# EAGLE design seq__control_pad_03 (EAGLE 7.7.0)

## Sheet 1 of 2
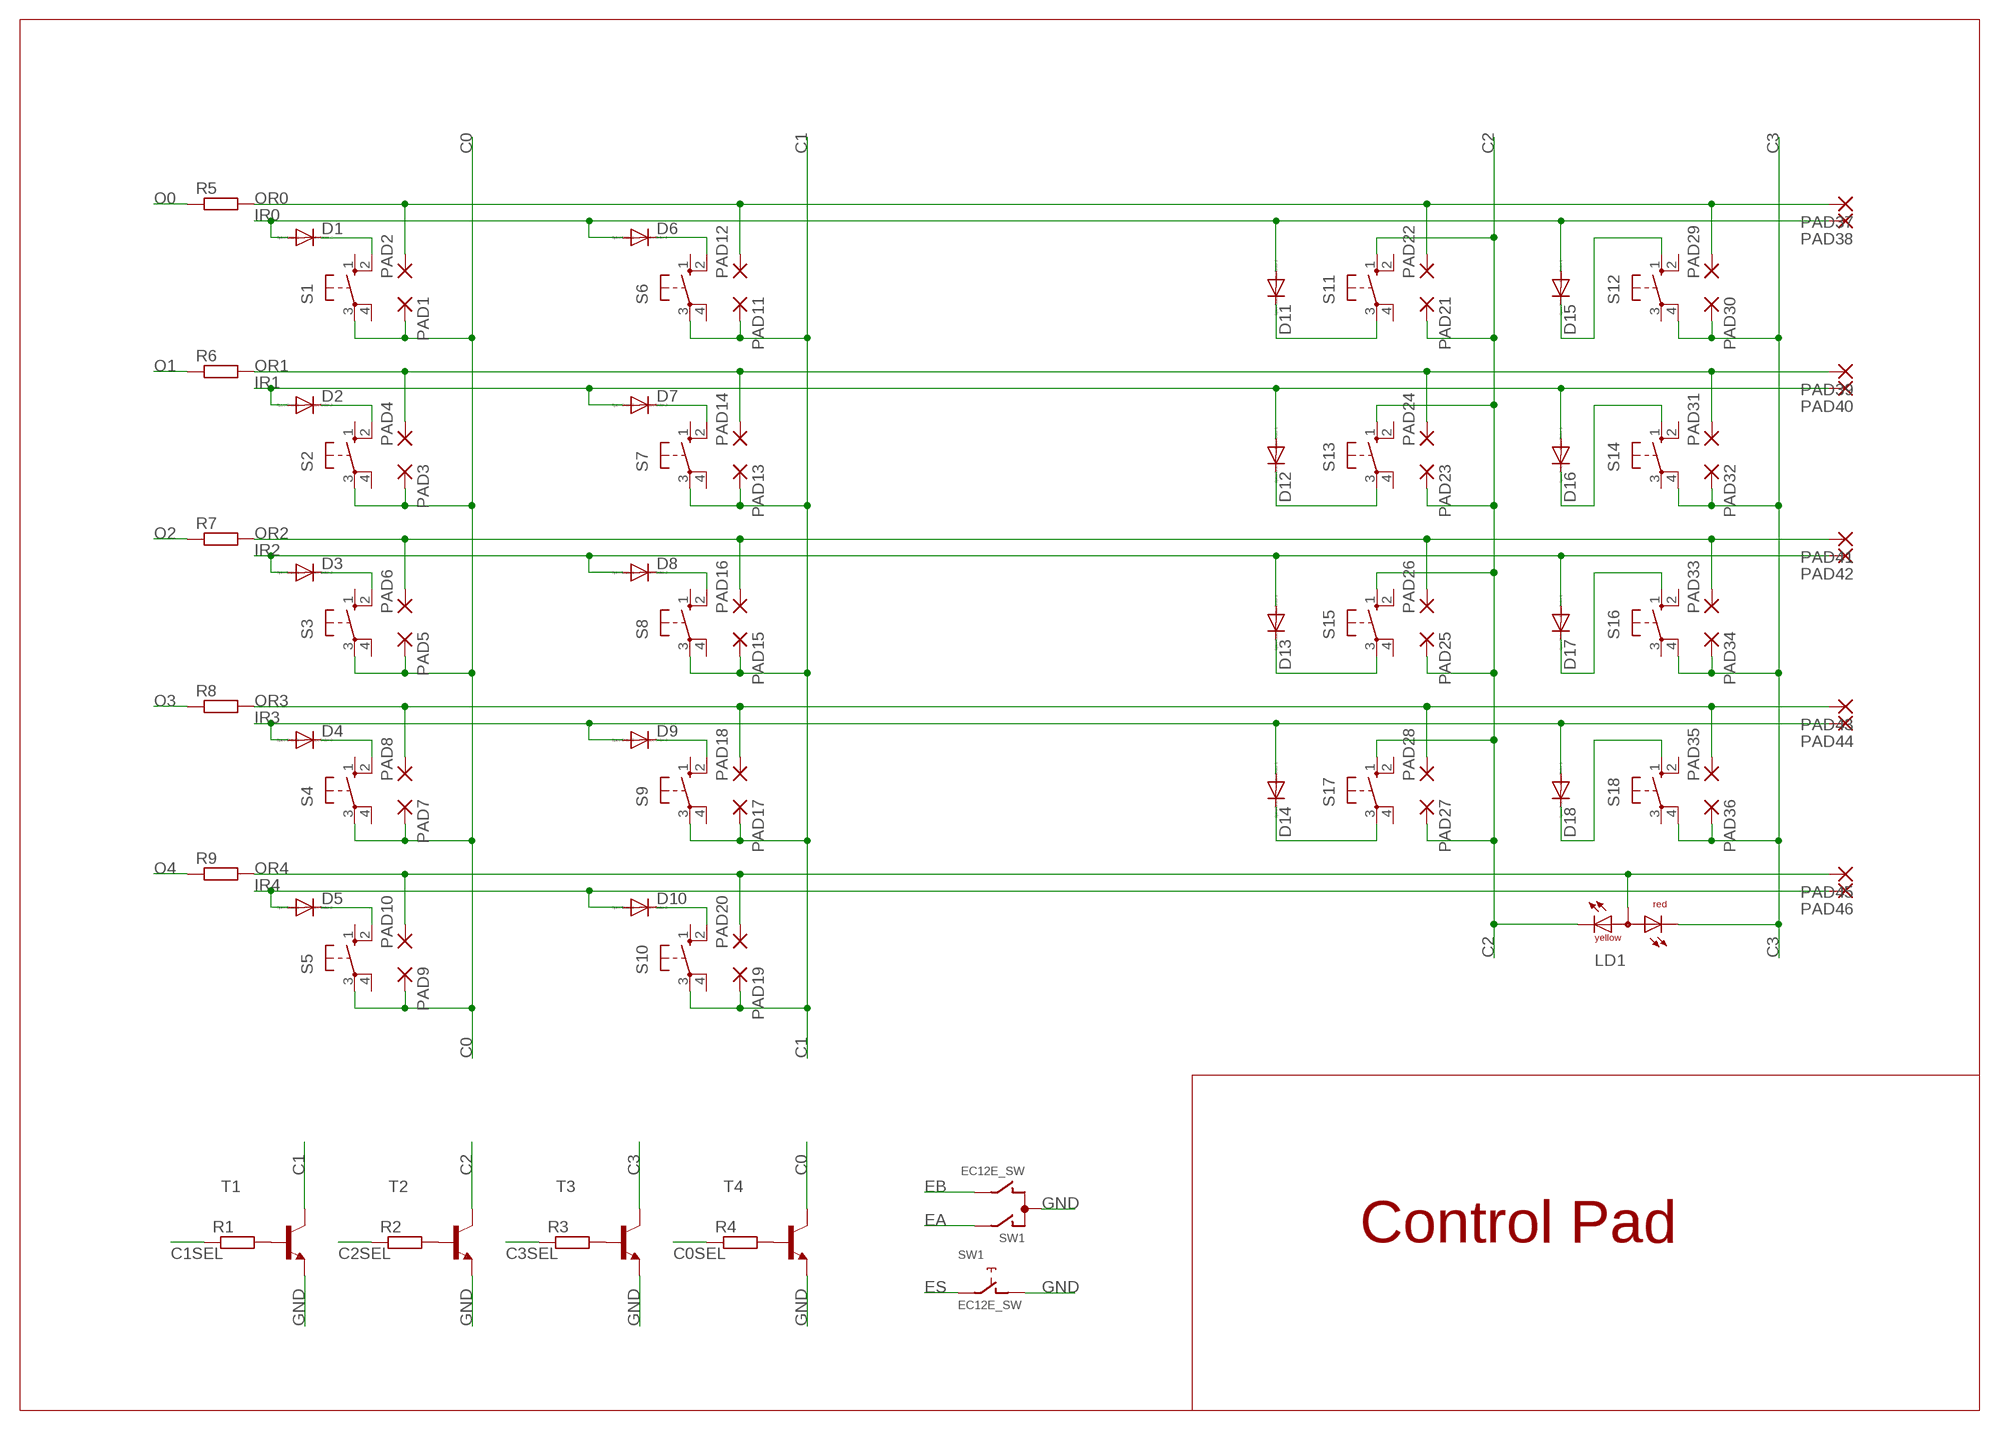
[diagram p0: schematic, sheet 1]

### Parts
D1  DIODE-MINIMELF  [MINIMELF]
D2  DIODE-MINIMELF  [MINIMELF]
D3  DIODE-MINIMELF  [MINIMELF]
D4  DIODE-MINIMELF  [MINIMELF]
D5  DIODE-MINIMELF  [MINIMELF]
D6  DIODE-MINIMELF  [MINIMELF]
D7  DIODE-MINIMELF  [MINIMELF]
D8  DIODE-MINIMELF  [MINIMELF]
D9  DIODE-MINIMELF  [MINIMELF]
D10  DIODE-MINIMELF  [MINIMELF]
D11  DIODE-MINIMELF  [MINIMELF]
D12  DIODE-MINIMELF  [MINIMELF]
D13  DIODE-MINIMELF  [MINIMELF]
D14  DIODE-MINIMELF  [MINIMELF]
D15  DIODE-MINIMELF  [MINIMELF]
D16  DIODE-MINIMELF  [MINIMELF]
D17  DIODE-MINIMELF  [MINIMELF]
D18  DIODE-MINIMELF  [MINIMELF]
LD1  DUOLED-RY-A  [DUOLED-A-5MM]
PAD1  1,6/0,8  [1,6/0,8]
PAD2  1,6/0,8  [1,6/0,8]
PAD3  1,6/0,8  [1,6/0,8]
PAD4  1,6/0,8  [1,6/0,8]
PAD5  1,6/0,8  [1,6/0,8]
PAD6  1,6/0,8  [1,6/0,8]
PAD7  1,6/0,8  [1,6/0,8]
PAD8  1,6/0,8  [1,6/0,8]
PAD9  1,6/0,8  [1,6/0,8]
PAD10  1,6/0,8  [1,6/0,8]
PAD11  1,6/0,8  [1,6/0,8]
PAD12  1,6/0,8  [1,6/0,8]
PAD13  1,6/0,8  [1,6/0,8]
PAD14  1,6/0,8  [1,6/0,8]
PAD15  1,6/0,8  [1,6/0,8]
PAD16  1,6/0,8  [1,6/0,8]
PAD17  1,6/0,8  [1,6/0,8]
PAD18  1,6/0,8  [1,6/0,8]
PAD19  1,6/0,8  [1,6/0,8]
PAD20  1,6/0,8  [1,6/0,8]
PAD21  1,6/0,8  [1,6/0,8]
PAD22  1,6/0,8  [1,6/0,8]
PAD23  1,6/0,8  [1,6/0,8]
PAD24  1,6/0,8  [1,6/0,8]
PAD25  1,6/0,8  [1,6/0,8]
PAD26  1,6/0,8  [1,6/0,8]
PAD27  1,6/0,8  [1,6/0,8]
PAD28  1,6/0,8  [1,6/0,8]
PAD29  1,6/0,8  [1,6/0,8]
PAD30  1,6/0,8  [1,6/0,8]
PAD31  1,6/0,8  [1,6/0,8]
PAD32  1,6/0,8  [1,6/0,8]
PAD33  1,6/0,8  [1,6/0,8]
PAD34  1,6/0,8  [1,6/0,8]
PAD35  1,6/0,8  [1,6/0,8]
PAD36  1,6/0,8  [1,6/0,8]
PAD37  1,6/0,8  [1,6/0,8]
PAD38  1,6/0,8  [1,6/0,8]
PAD39  1,6/0,8  [1,6/0,8]
PAD40  1,6/0,8  [1,6/0,8]
PAD41  1,6/0,8  [1,6/0,8]
PAD42  1,6/0,8  [1,6/0,8]
PAD43  1,6/0,8  [1,6/0,8]
PAD44  1,6/0,8  [1,6/0,8]
PAD45  1,6/0,8  [1,6/0,8]
PAD46  1,6/0,8  [1,6/0,8]
R1  R-EU_R0805  [R0805]
R2  R-EU_R0805  [R0805]
R3  R-EU_R0805  [R0805]
R4  R-EU_R0805  [R0805]
R5  R-EU_R0805  [R0805]
R6  R-EU_R0805  [R0805]
R7  R-EU_R0805  [R0805]
R8  R-EU_R0805  [R0805]
R9  R-EU_R0805  [R0805]
S1  40-XX  [B3F-40XX]
S2  40-XX  [B3F-40XX]
S3  40-XX  [B3F-40XX]
S4  40-XX  [B3F-40XX]
S5  40-XX  [B3F-40XX]
S6  40-XX  [B3F-40XX]
S7  40-XX  [B3F-40XX]
S8  40-XX  [B3F-40XX]
S9  40-XX  [B3F-40XX]
S10  40-XX  [B3F-40XX]
S11  40-XX  [B3F-40XX]
S12  40-XX  [B3F-40XX]
S13  40-XX  [B3F-40XX]
S14  40-XX  [B3F-40XX]
S15  40-XX  [B3F-40XX]
S16  40-XX  [B3F-40XX]
S17  40-XX  [B3F-40XX]
S18  40-XX  [B3F-40XX]
SW1  EC12E_SW  [ALPS_EC12E_SW]
T1  MMBT3904LT1-NPN-SOT23-BEC  [SOT23-BEC]
T2  MMBT3904LT1-NPN-SOT23-BEC  [SOT23-BEC]
T3  MMBT3904LT1-NPN-SOT23-BEC  [SOT23-BEC]
T4  MMBT3904LT1-NPN-SOT23-BEC  [SOT23-BEC]

### Nets
C0: PAD1.1(P) PAD3.1(P) PAD5.1(P) PAD7.1(P) PAD9.1(P) S1.3(P) S2.3(P) S3.3(P) S4.3(P) S5.3(P) T4.C
C0SEL: R4.1 ; also sheet 2
C1: PAD11.1(P) PAD13.1(P) PAD15.1(P) PAD17.1(P) PAD19.1(P) S6.3(P) S7.3(P) S8.3(P) S9.3(P) S10.3(P) T1.C
C1SEL: R1.1 ; also sheet 2
C2: LD1.CX(CY) PAD21.1(P) PAD23.1(P) PAD25.1(P) PAD27.1(P) S11.1(S) S13.1(S) S15.1(S) S17.1(S) T2.C
C2SEL: R2.1 ; also sheet 2
C3: LD1.CR PAD30.1(P) PAD32.1(P) PAD34.1(P) PAD36.1(P) S12.4(P1) S14.4(P1) S16.4(P1) S18.4(P1) T3.C
C3SEL: R3.1 ; also sheet 2
EA: SW1.A ; also sheet 2
EB: SW1.B ; also sheet 2
ES: SW1.E ; also sheet 2
GND: SW1.C SW1.D T1.E T2.E T3.E T4.E ; also sheet 2
IR0: D1.A D6.A D11.A D15.A PAD38.1(P) ; also sheet 2
IR1: D2.A D7.A D12.A D16.A PAD40.1(P) ; also sheet 2
IR2: D3.A D8.A D13.A D17.A PAD42.1(P) ; also sheet 2
IR3: D4.A D9.A D14.A D18.A PAD44.1(P) ; also sheet 2
IR4: D5.A D10.A PAD46.1(P) ; also sheet 2
N$1: D11.C S11.3(P)
N$2: R1.2 T1.B
N$3: R2.2 T2.B
N$4: R3.2 T3.B
N$5: D3.C S3.2(S1)
N$6: D16.C S14.1(S)
N$7: R4.2 T4.B
N$8: D17.C S16.1(S)
N$9: D18.C S18.1(S)
N$10: D1.C S1.2(S1)
N$11: D2.C S2.2(S1)
N$12: D5.C S5.2(S1)
N$13: D4.C S4.2(S1)
N$14: D6.C S6.2(S1)
N$15: D7.C S7.2(S1)
N$16: D8.C S8.2(S1)
N$17: D9.C S9.2(S1)
N$18: D10.C S10.2(S1)
N$19: D12.C S13.3(P)
N$20: D13.C S15.3(P)
N$21: D14.C S17.3(P)
N$23: D15.C S12.1(S)
O0: R5.1 ; also sheet 2
O1: R6.1 ; also sheet 2
O2: R7.1 ; also sheet 2
O3: R8.1 ; also sheet 2
O4: R9.1 ; also sheet 2
OR0: PAD2.1(P) PAD12.1(P) PAD22.1(P) PAD29.1(P) PAD37.1(P) R5.2
OR1: PAD4.1(P) PAD14.1(P) PAD24.1(P) PAD31.1(P) PAD39.1(P) R6.2
OR2: PAD6.1(P) PAD16.1(P) PAD26.1(P) PAD33.1(P) PAD41.1(P) R7.2
OR3: PAD8.1(P) PAD18.1(P) PAD28.1(P) PAD35.1(P) PAD43.1(P) R8.2
OR4: LD1.A PAD10.1(P) PAD20.1(P) PAD45.1(P) R9.2
Unconnected: S1.1(S) S1.4(P1) S2.1(S) S2.4(P1) S3.1(S) S3.4(P1) S4.1(S) S4.4(P1) S5.1(S) S5.4(P1) S6.1(S) S6.4(P1) S7.1(S) S7.4(P1) S8.1(S) S8.4(P1) S9.1(S) S9.4(P1) S10.1(S) S10.4(P1) S11.2(S1) S11.4(P1) S12.2(S1) S12.3(P) S13.2(S1) S13.4(P1) S14.2(S1) S14.3(P) S15.2(S1) S15.4(P1) S16.2(S1) S16.3(P) S17.2(S1) S17.4(P1) S18.2(S1) S18.3(P) SW1.GND1(G) SW1.GND2(G)

### Notes on the sheet
- Control Pad

## Sheet 2 of 2
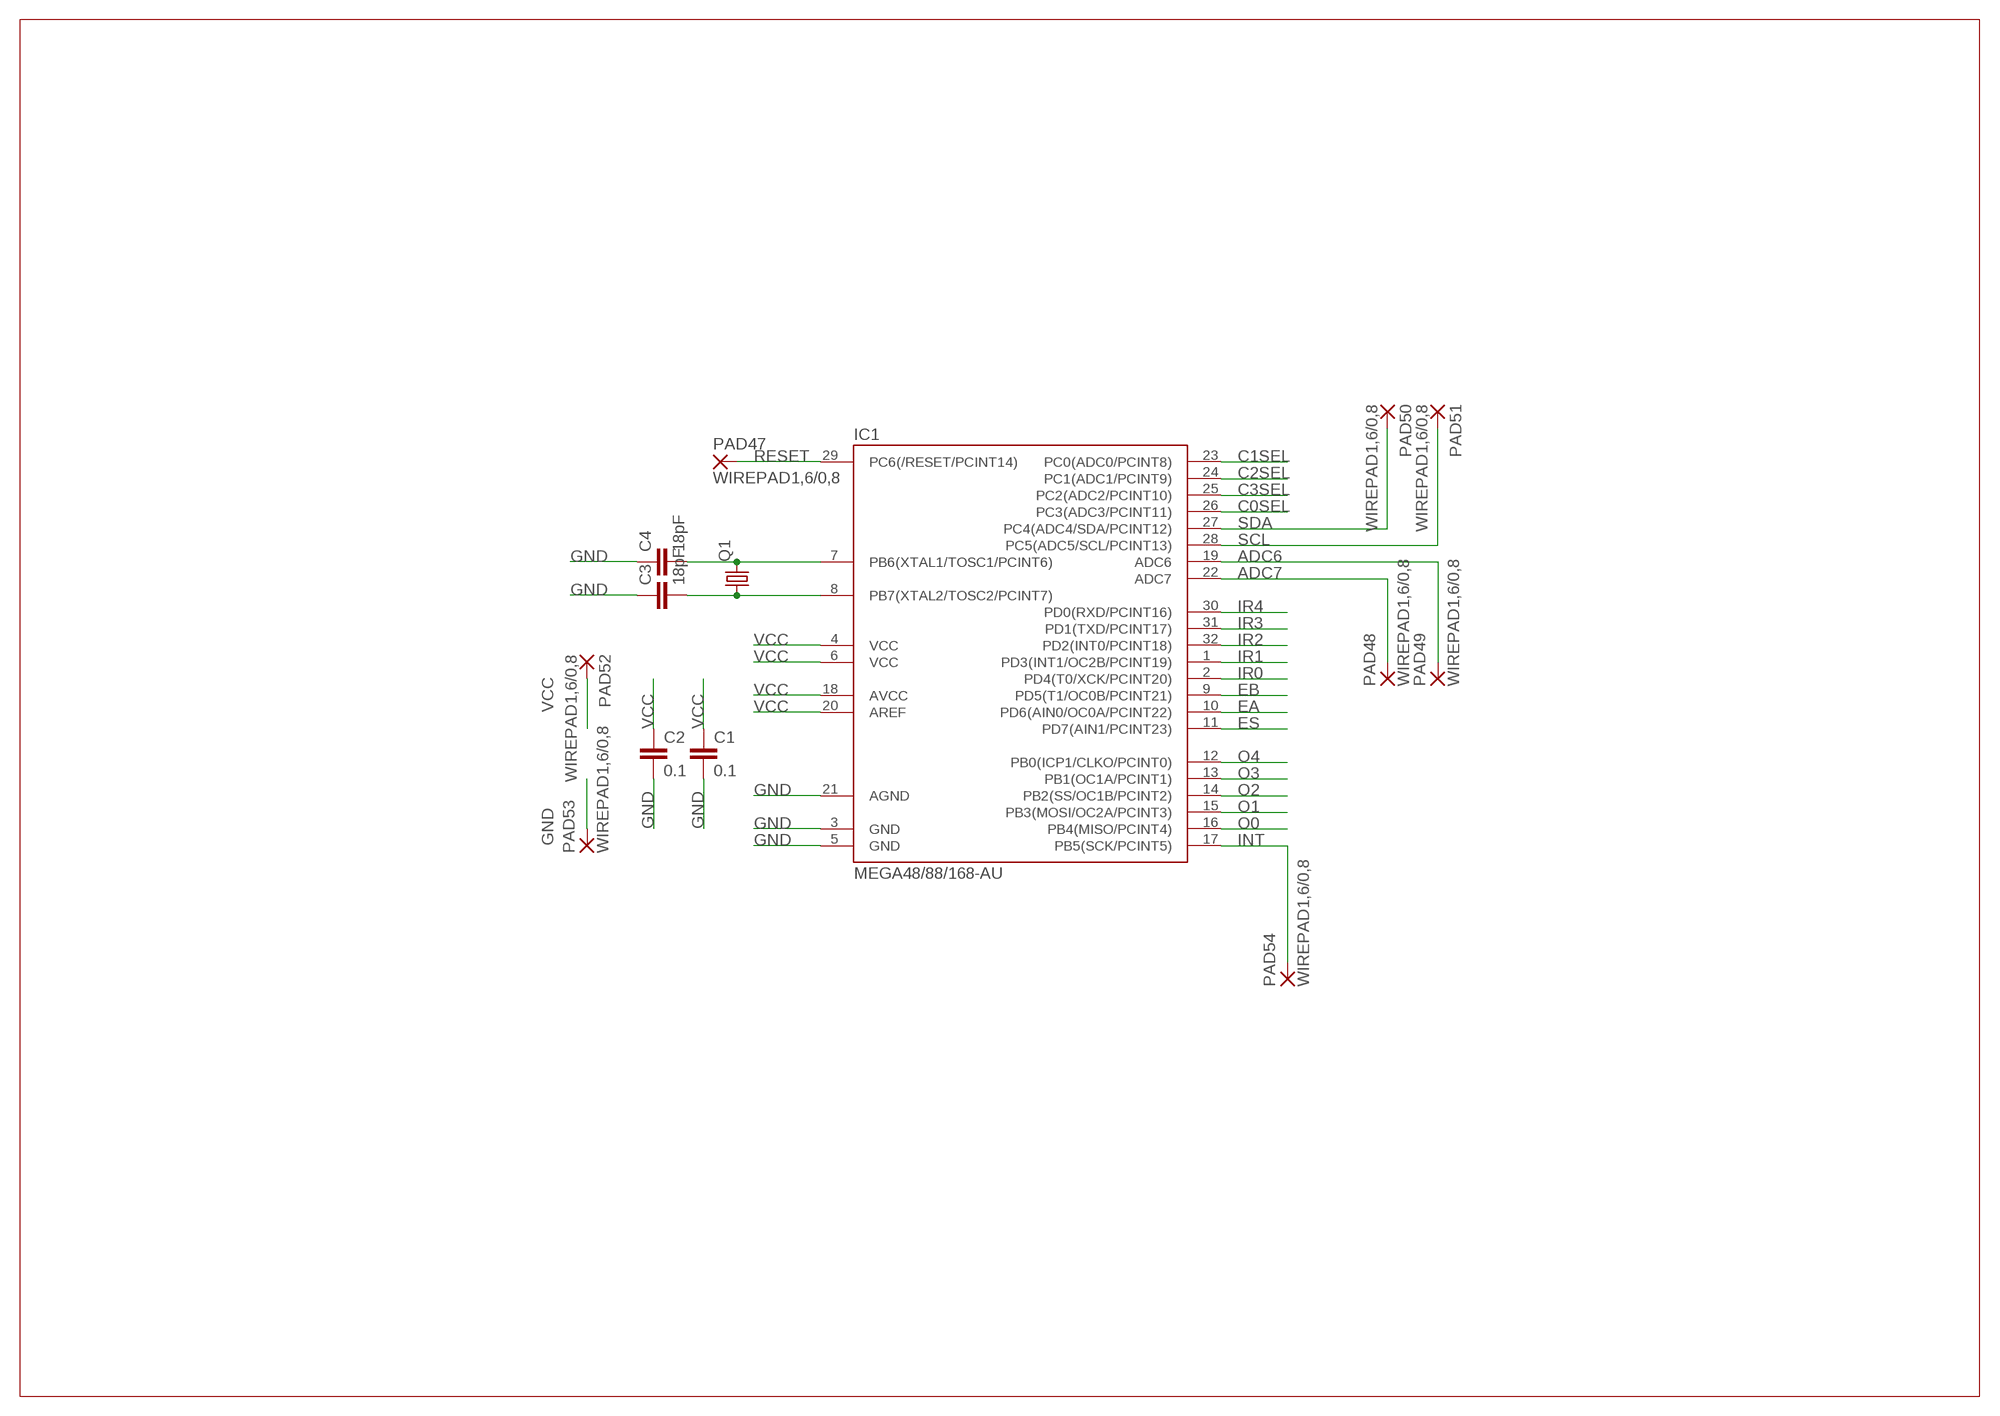
[diagram p1: schematic, sheet 2]

### Parts
C1  0.1  C-EUC0805  [C0805]
C2  0.1  C-EUC0805  [C0805]
C3  18pF  C-EUC0805  [C0805]
C4  18pF  C-EUC0805  [C0805]
IC1  MEGA48/88/168-AU  [TQFP32-08]
PAD47  WIREPAD1,6/0,8  [1,6/0,8]
PAD48  WIREPAD1,6/0,8  [1,6/0,8]
PAD49  WIREPAD1,6/0,8  [1,6/0,8]
PAD50  WIREPAD1,6/0,8  [1,6/0,8]
PAD51  WIREPAD1,6/0,8  [1,6/0,8]
PAD52  WIREPAD1,6/0,8  [1,6/0,8]
PAD53  WIREPAD1,6/0,8  [1,6/0,8]
PAD54  WIREPAD1,6/0,8  [1,6/0,8]
Q1  CRYSTALHC49S  [HC49/S]

### Nets
ADC6: IC1.19(ADC6) PAD49.1(P)
ADC7: IC1.22(ADC7) PAD48.1(P)
C0SEL: IC1.26(PC3(ADC3/PCINT11)) ; also sheet 1
C1SEL: IC1.23(PC0(ADC0/PCINT8)) ; also sheet 1
C2SEL: IC1.24(PC1(ADC1/PCINT9)) ; also sheet 1
C3SEL: IC1.25(PC2(ADC2/PCINT10)) ; also sheet 1
EA: IC1.10(PD6(AIN0/OC0A/PCINT22)) ; also sheet 1
EB: IC1.9(PD5(T1/OC0B/PCINT21)) ; also sheet 1
ES: IC1.11(PD7(AIN1/PCINT23)) ; also sheet 1
GND: C1.2 C2.2 C3.1 C4.1 IC1.3(GND) IC1.5(GND) IC1.21(AGND) PAD53.1(P) ; also sheet 1
INT: IC1.17(PB5(SCK/PCINT5)) PAD54.1(P)
IR0: IC1.2(PD4(T0/XCK/PCINT20)) ; also sheet 1
IR1: IC1.1(PD3(INT1/OC2B/PCINT19)) ; also sheet 1
IR2: IC1.32(PD2(INT0/PCINT18)) ; also sheet 1
IR3: IC1.31(PD1(TXD/PCINT17)) ; also sheet 1
IR4: IC1.30(PD0(RXD/PCINT16)) ; also sheet 1
O0: IC1.16(PB4(MISO/PCINT4)) ; also sheet 1
O1: IC1.15(PB3(MOSI/OC2A/PCINT3)) ; also sheet 1
O2: IC1.14(PB2(SS/OC1B/PCINT2)) ; also sheet 1
O3: IC1.13(PB1(OC1A/PCINT1)) ; also sheet 1
O4: IC1.12(PB0(ICP1/CLKO/PCINT0)) ; also sheet 1
RESET: IC1.29(PC6(/RESET/PCINT14)) PAD47.1(P)
SCL: IC1.28(PC5(ADC5/SCL/PCINT13)) PAD51.1(P)
SDA: IC1.27(PC4(ADC4/SDA/PCINT12)) PAD50.1(P)
VCC: C1.1 C2.1 IC1.4(VCC) IC1.6(VCC) IC1.18(AVCC) IC1.20(AREF) PAD52.1(P)
XTAL1: C4.2 IC1.7(PB6(XTAL1/TOSC1/PCINT6)) Q1.2
XTAL2: C3.2 IC1.8(PB7(XTAL2/TOSC2/PCINT7)) Q1.1

## Library data of the parts
C1-C4 = rcl:C-EU: CAPACITOR, European symbol
D1-D18 = diode:DIODE-: DIODE
IC1 = avr-7:MEGA48/88/168
LD1 = led:DUOLED-RY-A: DUO LED 2 colors (red/yellow), 5 mm, round, common Anode www.ligitek.com or other producers.
PAD1-PAD46 = wirepad:1,6/0,8: THROUGH-HOLE PAD
PAD47-PAD54 = wirepad:WIREPAD: Wire PAD connect wire on PCB
Q1 = crystal:CRYSTAL: CRYSTAL; OC_FARNELL: 1667008; OC_NEWARK: unknown
R1-R9 = rcl:R-EU_: RESISTOR, European symbol
S1-S18 = switch-omron:40-XX: OMRON SWITCH; MF: OMRON COMPONENTS USA; MPN: B3F-4000; OC_FARNELL: 176434; OC_NEWARK: 36K3105
SW1 = switch-alps:EC12E_SW: ALPS rotary Encoder EC12E series with switch; MPN: EC12E2424407; OC_FARNELL: 1520813; OC_NEWARK: 74M1068
T1-T4 = transistor:*-NPN-: NPN Transistror BF959 corrected 2008.03.06

## Board
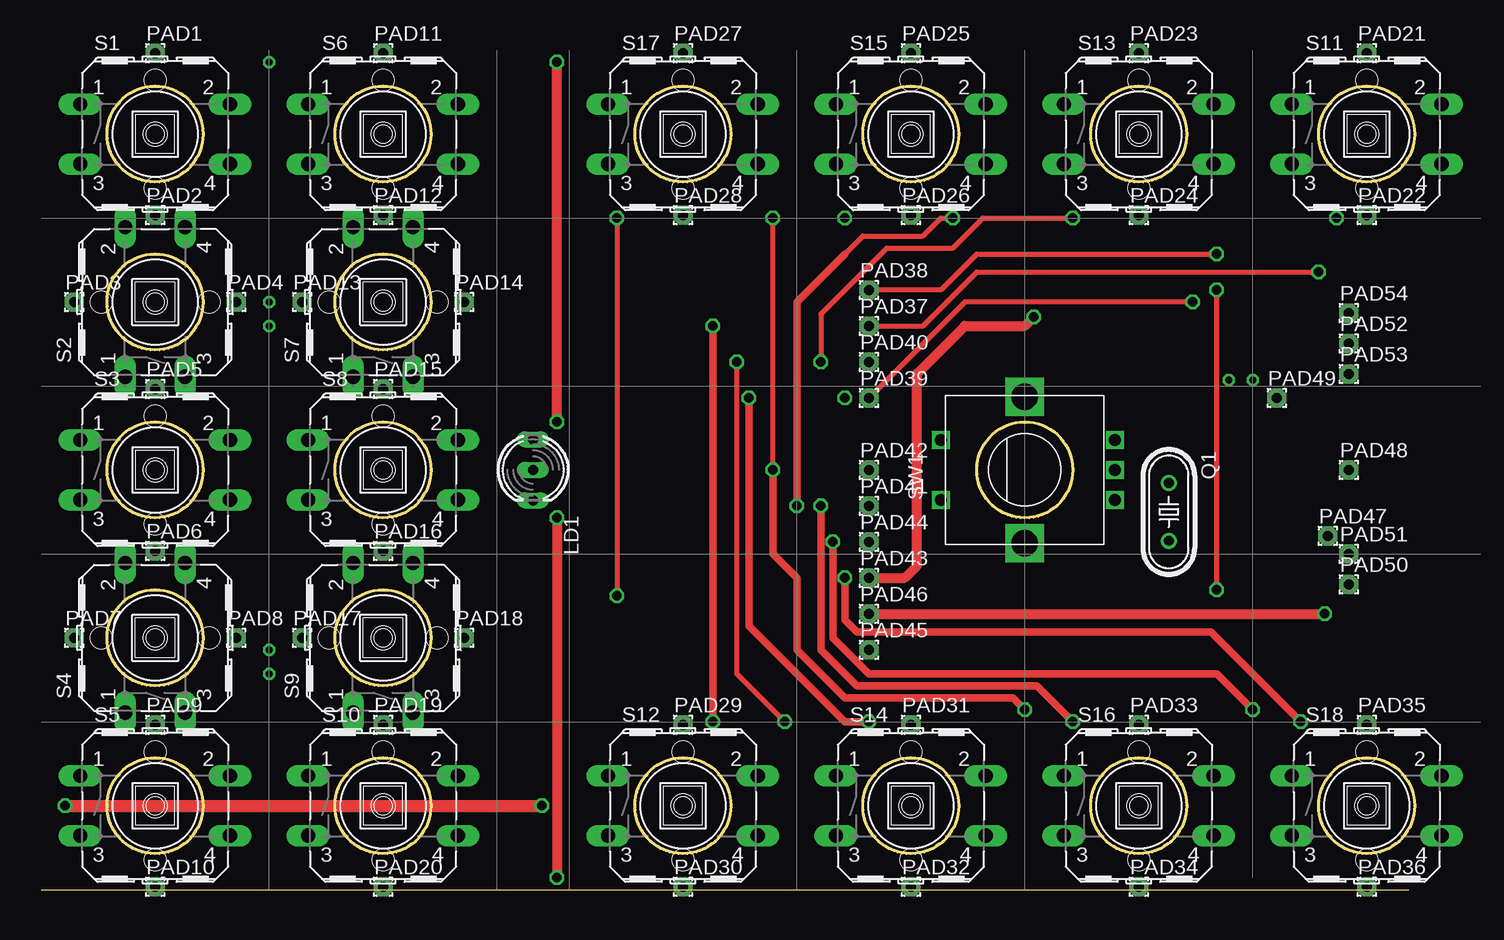
[diagram p2: board, top side]
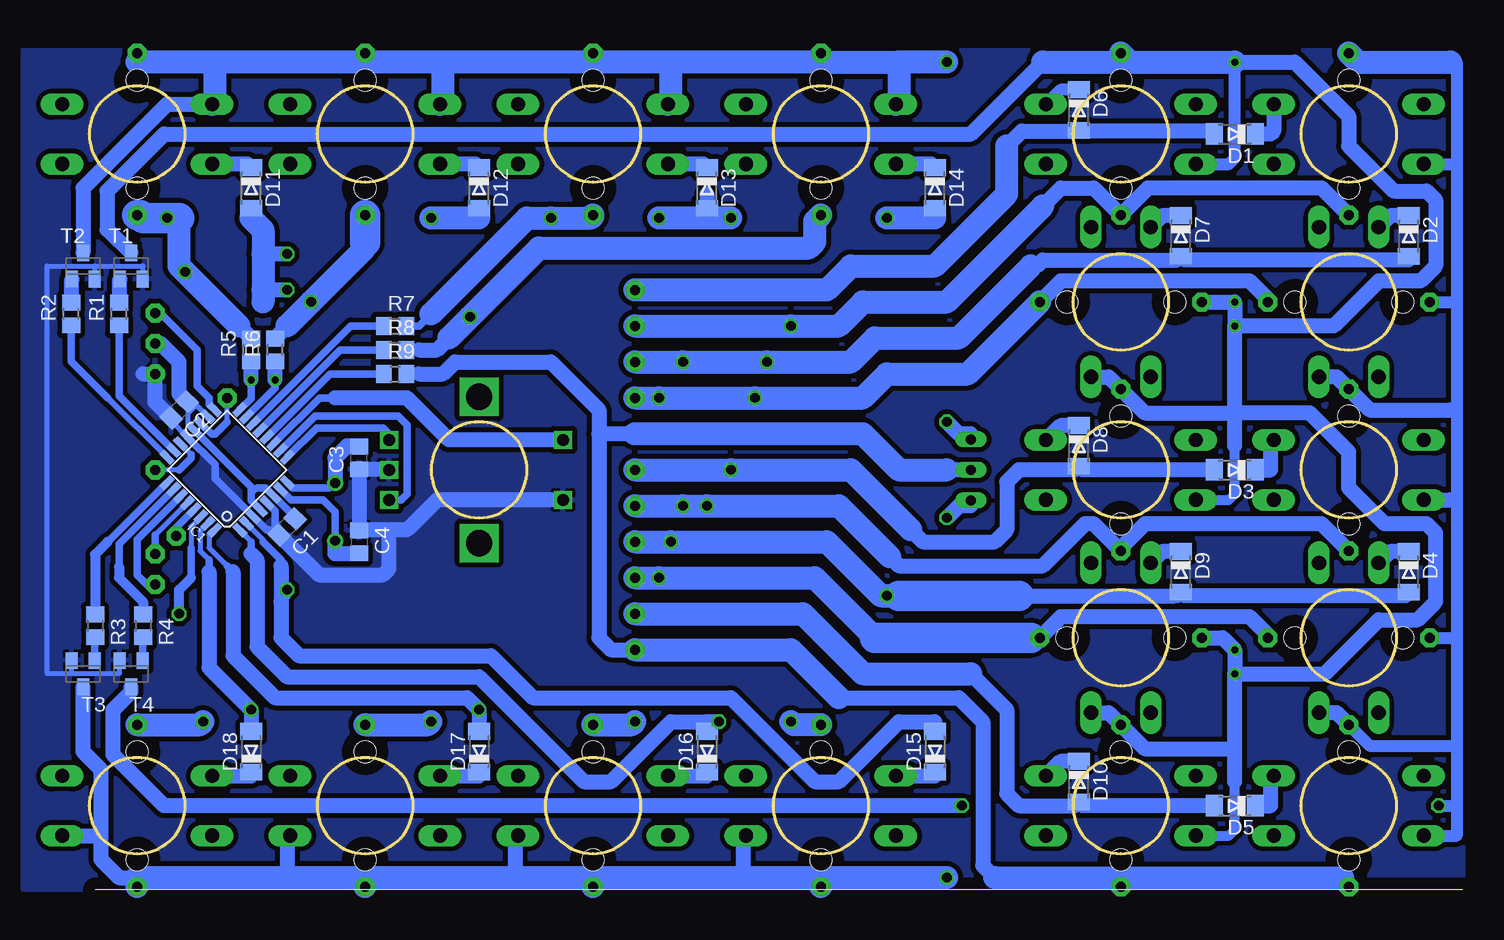
[diagram p3: board, bottom side, seen from below]

Size 114 x 0 mm. Coordinates in mm from the lower left corner, seen from the top.
Outline: 0,0 114,0
Copper layers (1*16): Top 0.035mm / dielectric 1.5mm / Bottom 0.035mm
Design rules "default": minimum track width 10mil, minimum drill 24mil, track to track 8mil, track to pad 8mil, pad to pad 8mil, via to via 8mil, smd to smd 8mil, copper to edge 40mil, drill to drill 8mil, minimum pad ring 10mil, minimum via ring 8mil, stop-mask expansion 4mil, vias tented up to drill 0mil, thermal gap 10mil
Milling: 77 lines

### Footprints (pad centres in the part's own frame; a part is rotated, then mirrored left to right if it is on the bottom)
C0805 = smd 1.3 x 1.5: 1 -0.95,0; 2 0.95,0
MINIMELF = smd 1.4 x 1.8: A 1.7,0; C -1.7,0
TQFP32-08 = smd 1.27 x 0.559: 1 -4.293,2.8; 2 -4.293,2; 3 -4.293,1.2; 4 -4.293,0.4; 5 -4.293,-0.4; 6 -4.293,-1.2; 7 -4.293,-2; 8 -4.293,-2.8; 17 4.293,-2.8; 18 4.293,-2; 19 4.293,-1.2; 20 4.293,-0.4; 21 4.293,0.4; 22 4.293,1.2; 23 4.293,2; 24 4.293,2.8 | smd 0.559 x 1.27: 9 -2.8,-4.293; 10 -2,-4.293; 11 -1.2,-4.293; 12 -0.4,-4.293; 13 0.4,-4.293; 14 1.2,-4.293; 15 2,-4.293; 16 2.8,-4.293; 25 2.8,4.293; 26 2,4.293; 27 1.2,4.293; 28 0.4,4.293; 29 -0.4,4.293; 30 -1.2,4.293; 31 -2,4.293; 32 -2.8,4.293
DUOLED-A-5MM = drill 0.813 long: A 0,0; CR 2.54,0; CX -2.54,0
1,6/0,8 = drill 0.813 pad 1.6 octagon: 1 0,0
HC49/S = drill 0.813: 1 -2.413,0; 2 2.413,0
R0805 = smd 1.3 x 1.5: 1 -0.95,0; 2 0.95,0
B3F-40XX = drill 1.194 long: 1 -6.248,2.489; 2 6.248,2.489; 3 -6.248,-2.489; 4 6.248,-2.489 | hole 1.803: 0,-4.496; 0,4.496
ALPS_EC12E_SW = drill 1 square: A -2.5,-7.5; B 2.5,-7.5; C 0,-7.5; D -2.5,7; E 2.5,7 | drill 2.2 square: GND1 -6.1,0; GND2 6.1,0
SOT23-BEC = smd 1 x 1.4: B -0.95,-1.1; C 0,1.1; E 0.95,-1.1

### Placement (x,y rotation side)
C1  98,30.25 225 bottom  (outside the outline)
C2  107,40 225 bottom  (outside the outline)
C3  92,36 90 bottom  (outside the outline)
C4  92,29 270 bottom  (outside the outline)
D1  19,63 180 bottom  (outside the outline)
D2  4.5,54.5 270 bottom  (outside the outline)
D3  19,35 180 bottom  (outside the outline)
D4  4.5,26.5 270 bottom  (outside the outline)
D5  19,7 180 bottom  (outside the outline)
D6  32,65 270 bottom  (outside the outline)
D7  23.5,54.5 270 bottom  (outside the outline)
D8  32,37 270 bottom  (outside the outline)
D9  23.5,26.5 270 bottom  (outside the outline)
D10  32,9 270 bottom  (outside the outline)
D11  101,58.5 270 bottom  (outside the outline)
D12  82,58.5 270 bottom  (outside the outline)
D13  63,58.5 270 bottom  (outside the outline)
D14  44,58.5 270 bottom  (outside the outline)
D15  44,11.5 90 bottom  (outside the outline)
D16  63,11.5 90 bottom  (outside the outline)
D17  82,11.5 90 bottom  (outside the outline)
D18  101,11.5 90 bottom  (outside the outline)
IC1  103,35 135 bottom  (outside the outline)
LD1  41,35 270 top  (outside the outline)
PAD1  9.5,69.75 0 top  (outside the outline)
PAD2  9.5,56.25 0 top  (outside the outline)
PAD3  2.75,49 0 top  (outside the outline)
PAD4  16.25,49 0 top  (outside the outline)
PAD5  9.5,41.75 0 top  (outside the outline)
PAD6  9.5,28.25 0 top  (outside the outline)
PAD7  2.75,21 0 top  (outside the outline)
PAD8  16.25,21 0 top  (outside the outline)
PAD9  9.5,13.75 0 top  (outside the outline)
PAD10  9.5,0.25 0 top
PAD11  28.5,69.75 0 top  (outside the outline)
PAD12  28.5,56.25 0 top  (outside the outline)
PAD13  21.75,49 0 top  (outside the outline)
PAD14  35.25,49 0 top  (outside the outline)
PAD15  28.5,41.75 0 top  (outside the outline)
PAD16  28.5,28.25 0 top  (outside the outline)
PAD17  21.75,21 0 top  (outside the outline)
PAD18  35.25,21 0 top  (outside the outline)
PAD19  28.5,13.75 0 top  (outside the outline)
PAD20  28.5,0.25 0 top
PAD21  110.5,69.75 0 top  (outside the outline)
PAD22  110.5,56.25 0 top  (outside the outline)
PAD23  91.5,69.75 0 top  (outside the outline)
PAD24  91.5,56.25 0 top  (outside the outline)
PAD25  72.5,69.75 0 top  (outside the outline)
PAD26  72.5,56.25 0 top  (outside the outline)
PAD27  53.5,69.75 0 top  (outside the outline)
PAD28  53.5,56.25 0 top  (outside the outline)
PAD29  53.5,13.75 0 top  (outside the outline)
PAD30  53.5,0.25 0 top
PAD31  72.5,13.75 0 top  (outside the outline)
PAD32  72.5,0.25 0 top
PAD33  91.5,13.75 0 top  (outside the outline)
PAD34  91.5,0.25 0 top
PAD35  110.5,13.75 0 top  (outside the outline)
PAD36  110.5,0.25 0 top
PAD37  69,47 0 top  (outside the outline)
PAD38  69,50 0 top  (outside the outline)
PAD39  69,41 0 top  (outside the outline)
PAD40  69,44 0 top  (outside the outline)
PAD41  69,32 0 top  (outside the outline)
PAD42  69,35 0 top  (outside the outline)
PAD43  69,26 0 top  (outside the outline)
PAD44  69,29 0 top  (outside the outline)
PAD45  69,20 0 top  (outside the outline)
PAD46  69,23 0 top  (outside the outline)
PAD47  107.25,29.5 0 top  (outside the outline)
PAD48  109,35 0 top  (outside the outline)
PAD49  103,41 0 top  (outside the outline)
PAD50  109,25.46 0 top  (outside the outline)
PAD51  109,28 0 top  (outside the outline)
PAD52  109,45.54 0 top  (outside the outline)
PAD53  109,43 0 top  (outside the outline)
PAD54  109,48.08 0 top  (outside the outline)
Q1  94,31.5 270 top  (outside the outline)
R1  112,48 90 bottom  (outside the outline)
R2  116,48 90 bottom  (outside the outline)
R3  114,22 270 bottom  (outside the outline)
R4  110,22 270 bottom  (outside the outline)
R5  101,45 90 bottom  (outside the outline)
R6  99,45 90 bottom  (outside the outline)
R7  89,47 0 bottom  (outside the outline)
R8  89,45 0 bottom  (outside the outline)
R9  89,43 0 bottom  (outside the outline)
S1  9.5,63 0 top  (outside the outline)
S2  9.5,49 90 top  (outside the outline)
S3  9.5,35 0 top  (outside the outline)
S4  9.5,21 90 top  (outside the outline)
S5  9.5,7 0 top
S6  28.5,63 0 top  (outside the outline)
S7  28.5,49 90 top  (outside the outline)
S8  28.5,35 0 top  (outside the outline)
S9  28.5,21 90 top  (outside the outline)
S10  28.5,7 0 top
S11  110.5,63 0 top  (outside the outline)
S12  53.5,7 0 top
S13  91.5,63 0 top  (outside the outline)
S14  72.5,7 0 top
S15  72.5,63 0 top  (outside the outline)
S16  91.5,7 0 top
S17  53.5,63 0 top  (outside the outline)
S18  110.5,7 0 top
SW1  82,35 90 top  (outside the outline)
T1  111,52 0 bottom  (outside the outline)
T2  115,52 0 bottom  (outside the outline)
T3  115,18 180 bottom  (outside the outline)
T4  111,18 180 bottom  (outside the outline)

### Tracks (layer width: path | path; a pad name or v marks a point on that pad's centre or on a via)
ADC6
  Bottom 0.406: 103,39 PAD49.1
  Bottom 0.61: IC1.19 104.3,38 104,38 103,39
ADC7
  Bottom 0.406: IC1.22 106,36.3 | 107,35 PAD48.1
  Bottom 0.61: 106,36.3 106,36 107,35
C0  (via drill 0.8)
  Top 1.016: v2,7 v41.75,7
  Bottom 1.016: 1,69 0.5,69 0.5,60.5 | 0.5,60.5 0.5,49 | 0.5,49 0.5,40 | 0.5,40 0.5,32.5 | 0.5,32.5 0.5,21 | 0.5,21 0.5,12 | 0.5,12 0.5,7 | 0.5,7 0.5,4.5 0.51,4.51 S5.3 | PAD3.1 0.5,49 | S1.3 0.51,60.51 0.5,60.5 | 1,40 0.5,40 | PAD9.1 7.75,12 0.5,12 | PAD7.1 0.5,21 | 1,32.5 0.5,32.5 | v2,7 0.5,7
  Bottom 1.27: 1,40 7.75,40 PAD5.1 10.5,42.75 S2.3 | S3.3 1.01,32.51 1,32.5 | PAD9.1 10.5,14.75 S4.3 | v41.75,7 108.25,7 112.5,11.25 112.5,15 111,16.5 T4.C
  Bottom 1.93: PAD1.1 8.75,69 1,69
C0SEL
  Bottom 0.61: IC1.26 112,28.83 112,26.95
  Bottom 0.813: 112,26.95 112,26 110,24 R4.1
C1  (via drill 0.6)
  Bottom 0.813: S8.3 19.49,32.51 19,33 19,37 | S10.3 19.49,4.51 19,5 19,9
  Bottom 1.016: S6.3 19.49,60.51 19,61 v19,69
  Bottom 1.27: v19,47 v19,49 PAD13.1 | 19,39.75 26.5,39.75 PAD15.1 29.5,42.75 S7.3 | 19,39.75 v19,47 | 19,37 19,39.75 | 19,9 19,11.75 | 19,11.75 v19,18 | PAD17.1 20,21 v19,20 v19,18 | S9.3 29.5,14.75 PAD19.1 26.5,11.75 19,11.75 | 35,69 41,63 108.25,63 113,58.25 113,55 112.9,55 T1.C | 29.25,69 PAD11.1 | v19,18 11.5,18 7,22.5 3.75,22.5 2.25,24 2.25,29.75 3,30.5 6.5,30.5 9.5,33.5 9.5,36.5 12.75,39.75 19,39.75 | v19,69 14,69 9.5,64.5 9.5,62 5.75,58.25 3,58.25 2.25,57.5 2.25,52 3.5,50.75 7,50.75 10.75,47 v19,47
  Bottom 1.93: PAD11.1 27.75,69 v19,69 | 35,69 29.25,69
C1SEL
  Bottom 0.61: IC1.23 112,41.17 R1.1
C2  (via drill 0.8)
  Top 0.813: v43,39 v43,69
  Bottom 1.016: 104.26,65.5 S11.1
  Bottom 1.27: 53.5,69 PAD27.1 | PAD25.1 73,69.25 73,69 | PAD23.1 91.5,69 | PAD21.1 110.5,69 | 104.26,65.5 108,65.5 115,58.5 T2.C | LD1.CX 41,38 42,38 v43,39
  Bottom 1.93: 66,69 53.5,69 47,69 | 66,69 73,69 85,69 | 85,69 91.5,69 104,69 | 104,69 110.5,69 | 47,69 47,66 47.25,65.75 S17.1 | S15.1 66,65.74 66,69 | S13.1 85,65.74 85,69 | S11.1 104,65.74 104,69 | v43,69 47,69
C2SEL
  Bottom 0.5: IC1.24 112.96,41
  Bottom 0.61: 112.96,41 116,44.04 R2.1
C3  (via drill 0.8)
  Top 0.813: v43,31 v43,1
  Bottom 1.27: 110.5,1 112,1 113.5,2.5 113.5,4.51 | 113.5,4.51 113.5,10 115,11.5 T3.C | S12.4 60,4.26 60,1 | S14.4 79,4.26 79,1 | S16.4 98,4.26 98,1 | S18.4 113.5,4.51 | LD1.CR 41,32 42,32 v43,31
  Bottom 1.93: PAD30.1 53.5,1 | 53.5,1 60,1 72.5,1 | 72.5,1 79,1 91.5,1 | 91.5,1 98,1 110.5,1 PAD36.1 | PAD32.1 72.5,1 | PAD34.1 91.5,1 | v43,1 53.5,1
C3SEL
  Bottom 0.61: IC1.25 112.96,29
  Bottom 0.813: 112.96,29 114,27.96 R3.1
EA
  Bottom 0.61: IC1.10 95.67,39.5 88.75,39.5 88,38.75 88,33 88.5,32.5 SW1.A
EB
  Bottom 0.61: IC1.9 95.54,38.5 90,38.5 89.5,38 SW1.B
ES
  Bottom 0.61: 94,41 95.3,41 IC1.11
  Bottom 1.27: SW1.E 84.5,37.5 88,41 94,41
GND
  Bottom 0.406: 99,30 98.67,29.67 C1.2 98.67,29 98.09,29 | IC1.21 107.67,39.11 C2.2 | T4.E 112,19.1 112,18 116,18 | 116,18 118,18 118,52 114,52 | 114,52 110.05,52 | 110,52 110.05,52 | 110.05,52 T1.E | T2.E 114,50.9 114,52 | T3.E 116,19.1 116,18
  Bottom 0.61: IC1.5 99,31.57 99,30 99.7,30 IC1.3 104,34.3 104,35.43 IC1.21
  Bottom 1.27: SW1.C 89.55,35.05 C3.1 C4.1 91.95,30 89.5,30 | SW1.D 85.5,32.5 88,30 89.5,30 | C2.2 109,40.66 PAD53.1 110,43 | 98.09,29 95.34,26.25 90,26.25 89.5,26.75 89.5,30
  pour Bottom (isolate 0.406): 0,0 120,0 120,70 0,70
INT
  Bottom 0.61: IC1.17 104.5,40.46 104.5,41 105.5,42 105.5,45 108.58,48.08 PAD54.1
IR0  (via drill 0.8)
  Top 0.406: PAD38.1 75,50 78,53 v98,53 | v98,25 v98,50
  Bottom 0.406: IC1.2 100,29.17 100,29
  Bottom 0.61: 100,29 98.5,27.5 98.5,27 | v98,25 98,24.5 98.5,24
  Bottom 1.27: D1.A 21,63.3 D6.A 32.05,63.25 36.75,63.25 38,62 | 98.5,27 98.5,24 98.5,21 97,19.5 81,19.5 77.5,16 61,16 54,9 52,9 47,14 44,14 D15.A | D11.A 101,56 | v98,50 100,50 | v98,53 100,53
  Bottom 1.93: PAD38.1 53,50 51,52 44,52 38,58 38,62 | 101,56 100,55 100,53 100,50 100,49
IR1  (via drill 0.8)
  Top 0.406: v65,44 65,48 70.5,53.5 76,53.5 78.5,56 v86,56 | v62,14 58,18 v58,44
  Bottom 0.406: IC1.1 101,29.04 101,29
  Bottom 0.61: 101,29 101,28
  Bottom 1.27: D2.A 4.5,52.5 23.2,52.5 D7.A 23.8,52.5 35,52.5 35.5,52 36,52 | 101,28 100.5,27.5 100.5,20.25 98,17.75 82,17.75 73.25,9 71,9 66,14 63,14 | D12.A 82,56 | v62,14 63,14 | 63,14 D16.A
  Bottom 1.93: PAD40.1 v65,44 v58,44 51,44 49,46 42,46 36,52 | 82,56 v86,56
IR2  (via drill 0.8)
  Top 0.406: v61,35 v61,56
  Top 0.61: v82,15 81,16 67,16 63,20 63,26 61,28 v61,35
  Bottom 0.406: IC1.32 104.5,29.54 104.5,28.5 103,27
  Bottom 0.61: 103,27 102.5,26.5
  Bottom 1.27: D3.A 31.7,35 D8.A 32.3,35 37,35 38,34 38,30 39,29 45,29 46,30 | 63,58 D13.A 63,56 | 102.5,26.5 102.5,19.5 99,16 83,16 v82,15 D17.A
  Bottom 1.93: PAD42.1 v61,35 51,35 46,30 | v67,56 63,56 v61,56
IR3  (via drill 0.8)
  Top 0.406: v48,56 v48,24.5
  Top 0.61: v101,15 98,18 69,18 66,21 v66,29
  Bottom 0.406: IC1.31 105.25,29.92 105.25,28.25 104.5,27.5 | 48.5,24.5 48.5,25 49,25 49,24.5 v48,24.5
  Bottom 0.61: 104.5,27.5 104.5,26.5
  Bottom 1.27: D4.A 4.5,24.75 4.75,24.5 23.2,24.5 D9.A | 23.8,24.5 D9.A | 44,56 D14.A | 104.5,26.5 104.5,18.5 v101,15 D18.A | D9.A 23.7,24.8 24,24.5 37,24.5
  Bottom 1.93: PAD44.1 v66,29 53,29 49,25 48.5,24.5 v48,24.5 47,24.5 | 44,56 v48,56
  Bottom 2.54: 47,24.5 37,24.5
IR4  (via drill 0.8)
  Top 0.813: PAD46.1 v107,23
  Bottom 0.406: IC1.30 106,30.3 106,28.5
  Bottom 0.61: 106,28.5 106,26
  Bottom 0.813: v107,23 107,25 106,26
  Bottom 1.016: 31.7,7 D10.A
  Bottom 1.27: D5.A 31.7,7 | D10.A 32.3,7 37,7 38,8 38,15 41,18
  Bottom 1.93: PAD46.1 55,23 51,19 50,18 41,18
N$1
  Bottom 1.27: D11.C 101.31,60.51 S11.3
N$2
  Bottom 1.27: R1.2 111.95,48.95 T1.B
N$3
  Bottom 1.27: R2.2 115.95,48.95 T2.B
N$4
  Bottom 0.61: R3.2 114.05,21 T3.B
N$5
  Bottom 1.27: D3.C 16,35 16,37.24 S3.2
N$6
  Bottom 1.27: S14.1 63,9.49 D16.C
N$7
  Bottom 0.61: R4.2 110.05,21 T4.B
N$8
  Bottom 1.27: S16.1 82,9.49 D17.C
N$9
  Bottom 1.27: S18.1 101,9.49 D18.C
N$10
  Bottom 1.27: S1.2 15.75,63.25 16,63 D1.C
N$11
  Bottom 1.27: 6.96,55.2 S2.2 6.06,56.2 D2.C
N$12
  Bottom 1.27: D5.C 16,7 16,9.24 S5.2
N$13
  Bottom 1.27: 6.96,27.2 S4.2 6.06,28.2 D4.C
N$14
  Bottom 1.016: D6.C 33.54,66.7 S6.2
N$15
  Bottom 1.27: 25.96,55.2 S7.2 25.06,56.2 D7.C
N$16
  Bottom 1.27: D8.C 33.54,38.7 S8.2
N$17
  Bottom 1.27: 25.96,27.2 S9.2 25.06,28.2 D9.C
N$18
  Bottom 1.27: D10.C 33.54,10.7 S10.2
N$19
  Bottom 1.27: D12.C 82.31,60.51 S13.3
N$20
  Bottom 1.27: D13.C 63.31,60.51 S15.3
N$21
  Bottom 1.27: D14.C 44.31,60.51 S17.3
N$23
  Bottom 1.27: S12.1 44,9.49 D15.C
O0  (via drill 0.6)
  Bottom 0.61: IC1.16 101,40.96 v101,42.5
  Bottom 1.27: v101,42.5 R5.1
O1  (via drill 0.6)
  Bottom 0.61: IC1.15 99,41.83 v99,42.5
  Bottom 1.27: v99,42.5 R6.1
O2
  Bottom 0.61: IC1.14 92.7,47 R7.1
O3
  Bottom 0.61: IC1.13 93.57,45 R8.1
O4
  Bottom 0.61: IC1.12 94.43,43 R9.1
OR0  (via drill 0.8)
  Top 0.406: PAD37.1 73.5,47 78,51.5 v106.5,51.5
  Top 0.61: v56,14 v56,47
  Bottom 1.27: PAD2.1 11.75,58.5 26.25,58.5 PAD12.1 30.75,58.5 33.5,58.5 35,57 | R5.2 101,46 102,47
  Bottom 1.93: PAD37.1 v56,47 52,47 50,49 43,49 35,57 | PAD29.1 55.75,13.75 v56,14 | 102,47 v106.5,51.5 107,52 107,56
  Bottom 2.54: 107,56 v108,56 110,56 110.25,56.25 PAD22.1
OR1  (via drill 0.8)
  Top 0.406: v96,49 77,49 PAD39.1
  Top 0.61: v59,41 59,22 67,14 v69,14
  Bottom 1.27: PAD4.1 16.25,49.25 17.75,50.75 33.5,50.75 PAD14.1 35.25,48.75 | R6.2 99,46 98,47
  Bottom 1.93: PAD39.1 v67,41 v59,41 50,41 48,43 41.25,43 PAD14.1 | PAD31.1 69.25,13.75 v69,14 | 98,47 v96,49 91.5,53.5 91.5,54
  Bottom 2.54: 91.5,54 PAD24.1
OR2  (via drill 0.8)
  Top 0.406: 67,53 68.5,54.5 73.5,54.5 75,56 v76,56
  Top 0.61: 67,53 63,49 v63,32 | v86,14 83,17 68,17 65,20 v65,32
  Bottom 0.61: R7.2 87,47 86,48
  Bottom 1.27: PAD6.1 11.75,30.5 26.5,30.5 28.5,28.5 PAD16.1 30.75,30.5 31.5,30.5 35,27 47,27 47.75,27.75
  Bottom 1.93: PAD41.1 v65,32 v63,32 52,32 47.75,27.75 | 72.75,56 PAD26.1 arc90 72.75,56 | 86,48 78,56 v76,56 72.75,56 | PAD33.1 86.25,13.75 v86,14
OR3  (via drill 0.8)
  Top 0.61: v105,14 97.5,21.5 68,21.5 67,22.5 v67,26
  Top 0.813: PAD43.1 72,26 73,27 73,43 77,47 82,47 v82.75,47.75
  Bottom 0.61: R8.2 87,45
  Bottom 1.27: PAD8.1 16.25,21.25 17.75,22.75 33.5,22.75 PAD18.1 36,21 | 87,45 85.5,45 84.5,46
  Bottom 1.93: PAD43.1 v67,26 54,26 49,21 | 84.5,46 v82.75,47.75 77,53.5 54.5,53.5 54,54 54,55.75 PAD28.1 53.75,56 | PAD35.1 105.25,13.75 v105,14
  Bottom 2.54: 49,21 36,21
OR4
  Bottom 0.61: R9.2 87,43
  Bottom 1.27: 39,1 40,2 40,14 42,16 52,16 | 10,1 10,0.75 PAD10.1 | PAD20.1 28.5,0.5 29,1 | 87,43 85,43 84,44 76,44 72,40 72,38 | 72,38 72,21 71,20 PAD45.1 | LD1.A 43,35 | 69,38 72,38
  Bottom 1.93: 39,1 29,1 10,1 | 69,38 50,38 47,35 43,35 | PAD45.1 56,20 52,16
RESET
  Bottom 0.61: IC1.29 107.25,30.18 PAD47.1
SCL
  Bottom 0.406: IC1.28 109,29.57
  Bottom 0.61: 109,29.57 PAD51.1
SDA
  Bottom 0.61: IC1.27 110.5,29.2 110.5,26.25 109.71,25.46 PAD50.1
VCC
  Bottom 0.406: IC1.18 105.59,40.41 | 105.59,40.41 105.84,40.67 C2.1 | IC1.20 106.25,38.82 106.25,39.75 105.59,40.41 | 105.59,40.41 | 97.33,31.02 C1.1 | 101,33 100.5,33.5
  Bottom 0.61: 97.33,31.02 IC1.6 99.8,33.5 100.5,33.5 | IC1.4 101,32.43 101,33 101,33.57 IC1.20
  Bottom 1.27: C2.1 107,41.34 107,44 108.54,45.54 PAD52.1
XTAL1
  Bottom 0.61: IC1.7 97.67,32.5 95,32.5 94,31.5 Q1.2
  Bottom 1.27: C4.2 92.05,28 94,28 Q1.2
XTAL2
  Bottom 0.406: 94.5,33.5 94.09,33.91 Q1.1
  Bottom 0.61: IC1.8 97.54,33.5 94.5,33.5
  Bottom 1.27: C3.2 92.05,37 93,37 94,36 Q1.1